# EAGLE design encoder_board (EAGLE 9.4.2)

## Sheet 1 of 4
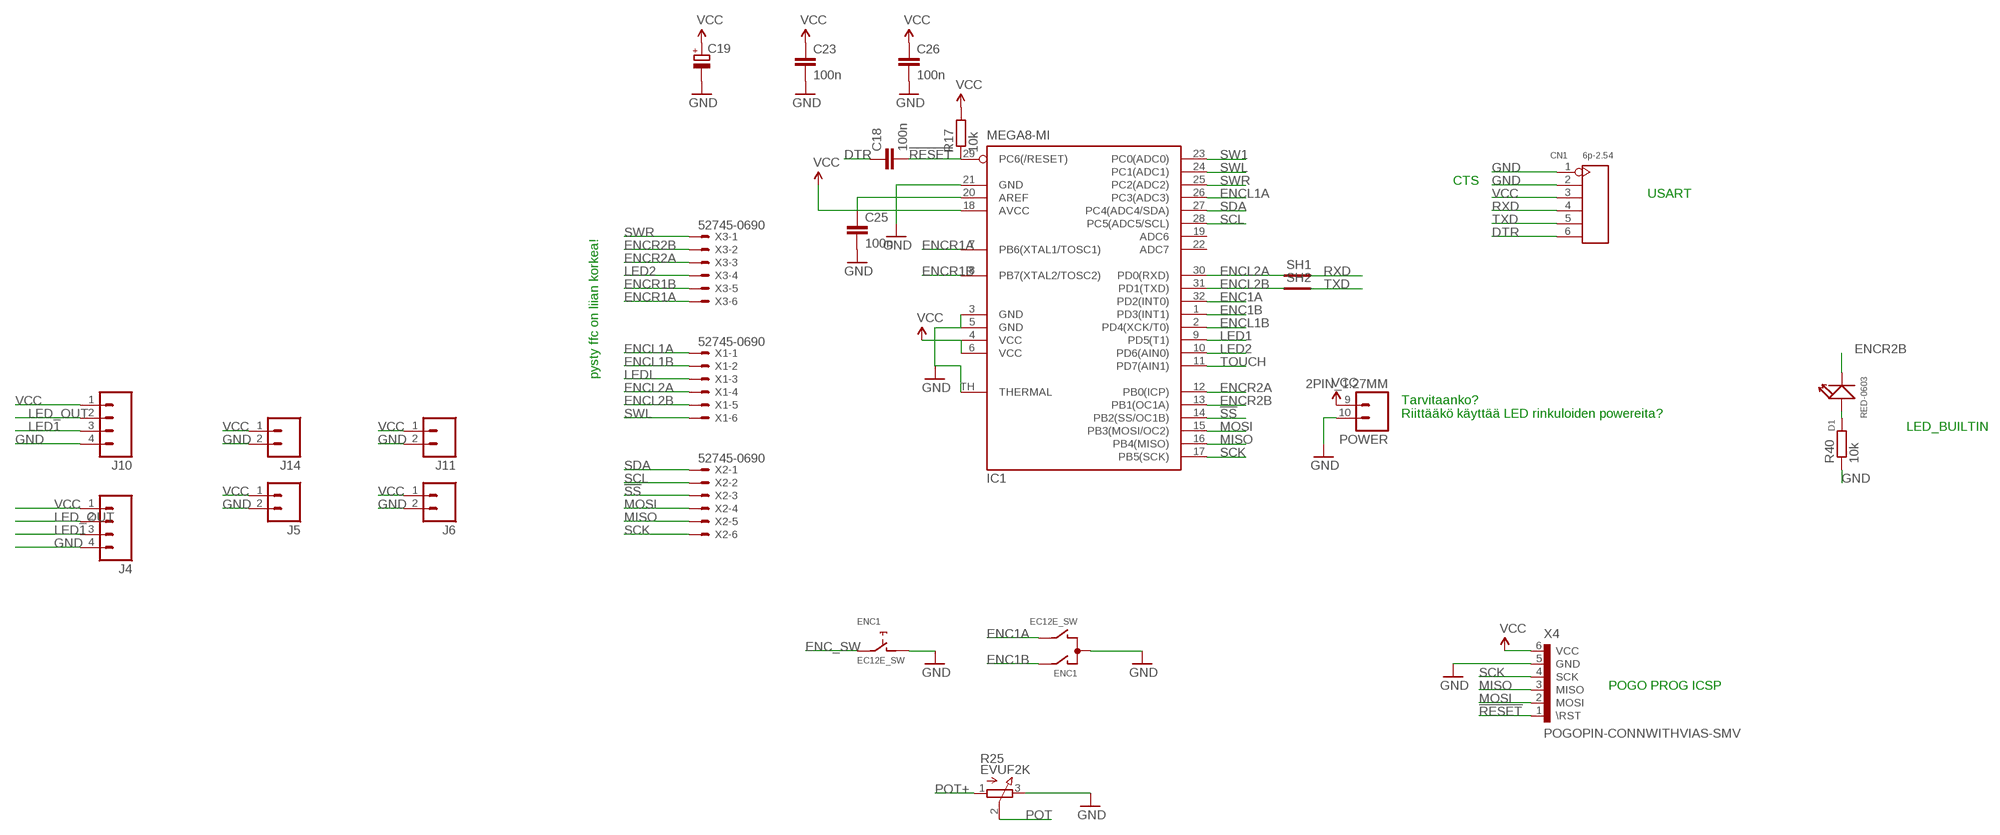
[diagram p0: schematic, sheet 1]

### Parts
C18  100n  CAP0603-CAP  [0603-CAP]
C19  CPOL-EUC  [PANASONIC_C]
C23  100n  CAP0603-CAP  [0603-CAP]
C25  100n  CAP0603-CAP  [0603-CAP]
C26  100n  CAP0603-CAP  [0603-CAP]
CN1  6p-2.54  DIP-BLACK-FEMALE-HEADER-VERT(6P-2.54)  [H6-2.54]
D1  RED-0603  LED-SMD-RED-DIFFUSED(0603)  [LED-0603]
ENC1  EC12E_SW  [ALPS_EC12E_SW]
IC1  MEGA8-MI  [MLF32-TH]
J4  M04NO_SILK_ALL_ROUND  [1X04_NO_SILK_ALL_ROUND]
J5  M021X02_NO_SILK  [1X02_NO_SILK]
J6  M021X02_NO_SILK  [1X02_NO_SILK]
J10  M04NO_SILK_ALL_ROUND  [1X04_NO_SILK_ALL_ROUND]
J11  M021X02_NO_SILK  [1X02_NO_SILK]
J14  M021X02_NO_SILK  [1X02_NO_SILK]
POWER  2PIN_1.27MM  [1X02_1.27MM_NO_SILK]
R17  10k  R-EU_R0603  [R0603]
R25  EVUF2K  [EVUFXK]
R40  10k  R-EU_R0603  [R0603]
SH1  SHORT  [SHORT_TOP_8MIL]
SH2  SHORT  [SHORT_TOP_8MIL]
X1  52745-0690  [52745-0690]
X2  52745-0690  [52745-0690]
X3  52745-0690  [52745-0690]
X4  POGOPIN-CONNWITHVIAS-SMV  [POGOPROG-CONN-OH-SMALLERVIAS]

### Nets
!RESET: C18.2 IC1.29(PC6(/RESET)) R17.1 X4.1(\RST)
!SS: IC1.14(PB2(SS/OC1B)) X2.3
AREF: C25.1 IC1.20(AREF)
DTR: C18.1 CN1.6
ENC1A: ENC1.B IC1.32(PD2(INT0)) ; also sheet 4
ENC1B: ENC1.A IC1.1(PD3(INT1)) ; also sheet 4
ENC_SW: ENC1.E ; also sheet 4
ENCL1A: IC1.26(PC3(ADC3)) X1.1 ; also sheet 4
ENCL1B: IC1.2(PD4(XCK/T0)) X1.2 ; also sheet 4
ENCL2A: IC1.30(PD0(RXD)) SH1.P$1 X1.4 ; also sheet 4
ENCL2B: IC1.31(PD1(TXD)) SH2.P$1 X1.5 ; also sheet 4
ENCR1A: IC1.7(PB6(XTAL1/TOSC1)) X3.6 ; also sheet 4
ENCR1B: IC1.8(PB7(XTAL2/TOSC2)) X3.5 ; also sheet 4
ENCR2A: IC1.12(PB0(ICP)) X3.3 ; also sheet 4
ENCR2B: D1.- IC1.13(PB1(OC1A)) X3.2 ; also sheet 4
GND: C19.- C23.2 C25.2 C26.2 CN1.1 CN1.2 ENC1.C ENC1.D IC1.3(GND) IC1.5(GND) IC1.21(GND) IC1.TH(THERMAL) J4.4 J5.2 J6.2 J10.4 J11.2 J14.2 POWER.10 R25.3(E) R40.1 X4.5(GND) ; also sheet 2,3
LED1: IC1.9(PD5(T1)) J4.3 J10.3 ; also sheet 4
LED2: IC1.10(PD6(AIN0)) X3.4 ; also sheet 4
LED_OUT: J4.2 J10.2 ; also sheet 4
LEDL: X1.3 ; also sheet 4
MISO: IC1.16(PB4(MISO)) X2.5 X4.3(MISO) ; also sheet 2
MOSI: IC1.15(PB3(MOSI/OC2)) X2.4 X4.2(MOSI) ; also sheet 2
N$31: D1.+ R40.2
POT: R25.2(S) ; also sheet 4
POT+: R25.1(A) ; also sheet 4
RXD: CN1.4 SH1.P$2
SCK: IC1.17(PB5(SCK)) X2.6 X4.4(SCK) ; also sheet 2
SCL: IC1.28(PC5(ADC5/SCL)) X2.2
SDA: IC1.27(PC4(ADC4/SDA)) X2.1
SW1: IC1.23(PC0(ADC0)) ; also sheet 4
SWL: IC1.24(PC1(ADC1)) X1.6 ; also sheet 4
SWR: IC1.25(PC2(ADC2)) X3.1 ; also sheet 4
TOUCH: IC1.11(PD7(AIN1)) ; also sheet 3,4
TXD: CN1.5 SH2.P$2
VCC: C19.+ C23.1 C26.1 CN1.3 IC1.4(VCC) IC1.6(VCC) IC1.18(AVCC) J4.1 J5.1 J6.1 J10.1 J11.1 J14.1 POWER.9 R17.2 X4.6(VCC) ; also sheet 3,4
Unconnected: ENC1.GND1(G) ENC1.GND2(G) IC1.19(ADC6) IC1.22(ADC7)

### Notes on the sheet
- CTS
- USART
- pysty ffc on liian korkea!
- Tarvitaanko?
  Riittääkö käyttää LED rinkuloiden powereita?
- LED_BUILTIN
- POGO PROG ICSP

## Sheet 2 of 4
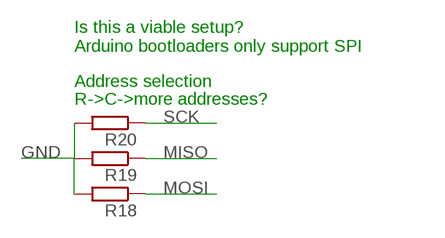
[diagram p1: schematic, sheet 2]

### Parts
R18  R-EU_R0603  [R0603]
R19  R-EU_R0603  [R0603]
R20  R-EU_R0603  [R0603]

### Nets
GND: R18.2 R19.2 R20.2 ; also sheet 1,3
MISO: R19.1 ; also sheet 1
MOSI: R18.1 ; also sheet 1
SCK: R20.1 ; also sheet 1

### Notes on the sheet
- Is this a viable setup?
  Arduino bootloaders only support SPI
- Address selection
- R->C->more addresses?

## Sheet 3 of 4
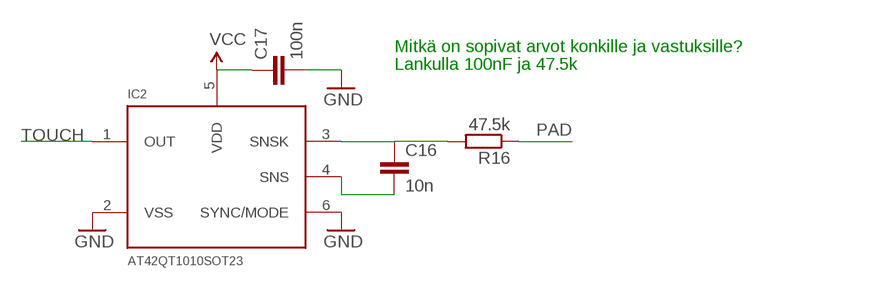
[diagram p2: schematic, sheet 3]

### Parts
C16  10n  CAP0603-CAP  [0603-CAP]
C17  100n  CAP0603-CAP  [0603-CAP]
IC2  AT42QT1010SOT23  [SOT23-6]
R16  47.5k  R-EU_R0603  [R0603]

### Nets
GND: C17.2 IC2.2(VSS) IC2.6(SYNC/MODE) ; also sheet 1,2
N$7: C16.1 IC2.3(SNSK) R16.2
N$15: C16.2 IC2.4(SNS)
PAD: R16.1
TOUCH: IC2.1(OUT) ; also sheet 1,4
VCC: C17.1 IC2.5(VDD) ; also sheet 1,4

### Notes on the sheet
- Mitkä on sopivat arvot konkille ja vastuksille?
- Lankulla 100nF ja 47.5k

## Sheet 4 of 4
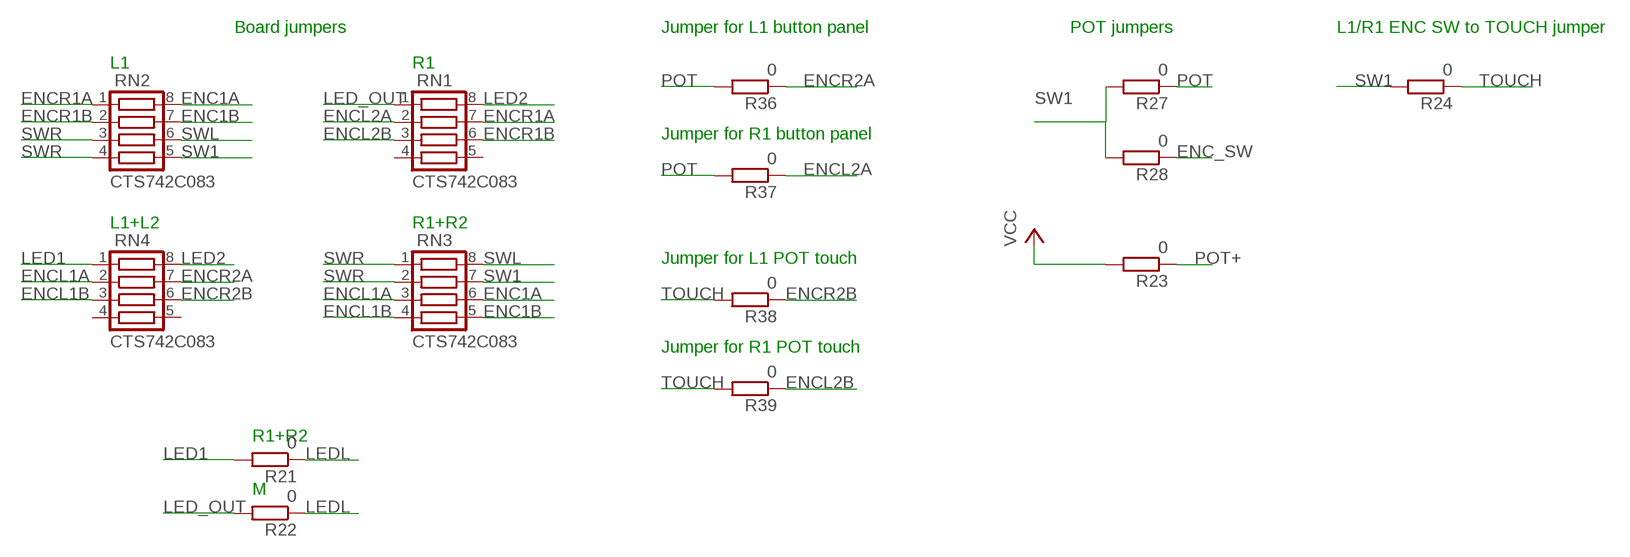
[diagram p3: schematic, sheet 4]

### Parts
R21  0  R-EU_R0603  [R0603]
R22  0  R-EU_R0603  [R0603]
R23  0  R-EU_R0603  [R0603]
R24  0  R-EU_R0603  [R0603]
R27  0  R-EU_R0603  [R0603]
R28  0  R-EU_R0603  [R0603]
R36  0  R-EU_R0603  [R0603]
R37  0  R-EU_R0603  [R0603]
R38  0  R-EU_R0603  [R0603]
R39  0  R-EU_R0603  [R0603]
RN1  CTS742C083  [CTS742C083]
RN2  CTS742C083  [CTS742C083]
RN3  CTS742C083  [CTS742C083]
RN4  CTS742C083  [CTS742C083]

### Nets
ENC1A: RN2.8 RN3.6 ; also sheet 1
ENC1B: RN2.7 RN3.5 ; also sheet 1
ENC_SW: R28.1 ; also sheet 1
ENCL1A: RN3.3 RN4.2 ; also sheet 1
ENCL1B: RN3.4 RN4.3 ; also sheet 1
ENCL2A: R37.1 RN1.2 ; also sheet 1
ENCL2B: R39.1 RN1.3 ; also sheet 1
ENCR1A: RN1.7 RN2.1 ; also sheet 1
ENCR1B: RN1.6 RN2.2 ; also sheet 1
ENCR2A: R36.1 RN4.7 ; also sheet 1
ENCR2B: R38.1 RN4.6 ; also sheet 1
LED1: R21.2 RN4.1 ; also sheet 1
LED2: RN1.8 RN4.8 ; also sheet 1
LED_OUT: R22.2 RN1.1 ; also sheet 1
LEDL: R21.1 R22.1 ; also sheet 1
POT: R27.1 R36.2 R37.2 ; also sheet 1
POT+: R23.1 ; also sheet 1
SW1: R24.2 R27.2 R28.2 RN2.5 RN3.7 ; also sheet 1
SWL: RN2.6 RN3.8 ; also sheet 1
SWR: RN2.3 RN2.4 RN3.1 RN3.2 ; also sheet 1
TOUCH: R24.1 R38.2 R39.2 ; also sheet 1,3
VCC: R23.2 ; also sheet 1,3
Unconnected: RN1.4 RN1.5 RN4.4 RN4.5

### Notes on the sheet
- Board jumpers | Jumper for L1 button panel | POT jumpers | L1/R1 ENC SW to TOUCH jumper
- L1 | R1
- Jumper for R1 button panel
- L1+L2 | R1+R2
- Jumper for L1 POT touch
- Jumper for R1 POT touch
- R1+R2
- M

## Library data of the parts
C16-C18 C23 C25 C26 = SparkFun-Capacitors:CAP: Capacitor Standard 0603 ceramic capacitor, and 0.1" leaded capacitor.
C19 = rcl:CPOL-EU: POLARIZED CAPACITOR, European symbol; SPICEPREFIX: C
CN1 = i2c_encoder:DIP-BLACK-FEMALE-HEADER-VERT(6P-2.54): 320030060; MPN: F185-1106A1BSYC1
D1 = Seeed-LED-2016:LED-SMD-RED-DIFFUSED(0603): 304090042; MPN: 19-217-R6C-AL1M2VY-3T
ENC1 = switch_pec:EC12E_SW: ALPS rotary Encoder EC12E series with switch; MPN: EC12E2424407; OC_FARNELL: 1520813; OC_NEWARK: 74M1068
IC1 = atmel:MEGA8-MI: MICROCONTROLLER 8 Kbytes FLASH, 1 kbytes SRAM, 512 bytes EEPROM, USART, 6-channel 10 bit ADC, 2-channel 8 bit ADC Pin compatible with Atmega48, ATMega88, ATMega168 Source: avr.lbr; MPN: ATMEGA88PA-MU; OC_FARNELL: 1715491; OC_NEWARK: 15R0272
IC2 = touch_sensor:AT42QT1010: Atmel AT42QT1010 The AT42QT1010 (QT1010) is a digital burst mode charge-transfer (QT™) sensor that is capable of detecting nearproximityor touch, making it ideal for implementing touch controls.The QT1010 is designed specifically for human interfaces, like control panels, appliances, toys, lighting controls, or anywhere a mechanical switch or button may be found. It includes all hardware and signal processing functions necessary to provide stable sensing under a wide variety of changing conditions. Only a single low-cost capacitor is required for operation. This chip is identical to the AT42QT1011, however the capsense times out after 60 seconds. Reciprocally, the capsense on the 1011 never times out. Reference "Signal Processing" in the datasheet. Datasheet <http://www.atmel.com/images/Atmel-9541-AT42-QTouch-BSW-AT42QT1010_Datasheet.pdf> Sparkfun Products Sparkfun Capacitive Touch Breakout <https://www.sparkfun.com/products/12041> (SEN-12041)
J4 J10 = i2c_encoder:M04: Header 4 Standard 4-pin 0.1" header. Use with straight break away headers (SKU : PRT-00116), right angle break away headers (PRT-00553), swiss pins (PRT-00743), machine pins (PRT-00117), and female headers (PRT-00115). Molex polarized connector foot print use with SKU : PRT-08231 with associated crimp pins and housings. 1MM SMD Version SKU: PRT-10208; PROD_ID: CONN-09696
J5 J6 J11 J14 = i2c_encoder:M02: Standard 2-pin 0.1" header. Use with - straight break away headers ( PRT-00116) - right angle break away headers (PRT-00553) - swiss pins (PRT-00743) - machine pins (PRT-00117) - female headers (PRT-00115) Molex polarized connector foot print use with: PRT-08233 with associated crimp pins and housings. 2.54_SCREWTERM for use with PRT-10571. 3.5mm Screw Terminal footprints for PRT-08084 5mm Screw Terminal footprints for use with PRT-08432
POWER = edge:2PIN_1.27MM
R16-R21 R40 = rcl:R-EU_: RESISTOR, European symbol
R22-R24 R27 R28 R36-R39 = rcl:R-EU_: RESISTOR, European symbol; SPICEPREFIX: R
R25 = i2c_encoder:EVU: Potentiometer modified from "9 mm Square Rotary Potentiometers (Source: Panasonic)"
RN1-RN4 = resistor-net:CTS742C083: Chip Resistor Array 4 Single Resistor Source: http://www.ctscorp.com/components/Datasheets/CTSChipArrayDs.pdf; OC_FARNELL: unknown; OC_NEWARK: unknown
SH1 SH2 = shorts:SHORT: Short between two nets
X1-X3 = i2c_encoder:52745-0690: FFC/FPC-to-Board 0.50mm (.020") SMT Top Contact Right Angle, ZIF, Style Receptacle 52745 / 52435 Source: http://www.molex.com/product/ffc/52745.html; MF: MOLEX; MPN: 52745-0690; OC_FARNELL: unknown; OC_NEWARK: 92M6374
X4 = Protofusion:POGOPIN-CONN: Protofusion custom pogo pin programming header

## Board
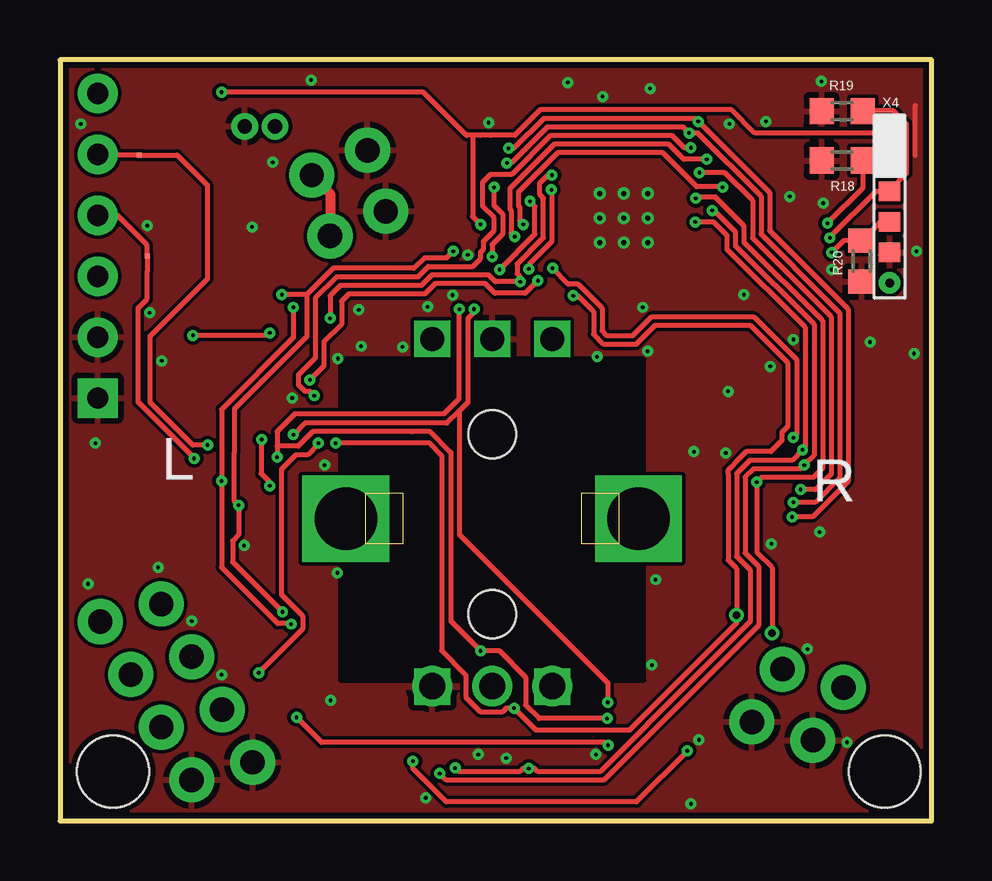
[diagram p4: board, top side]
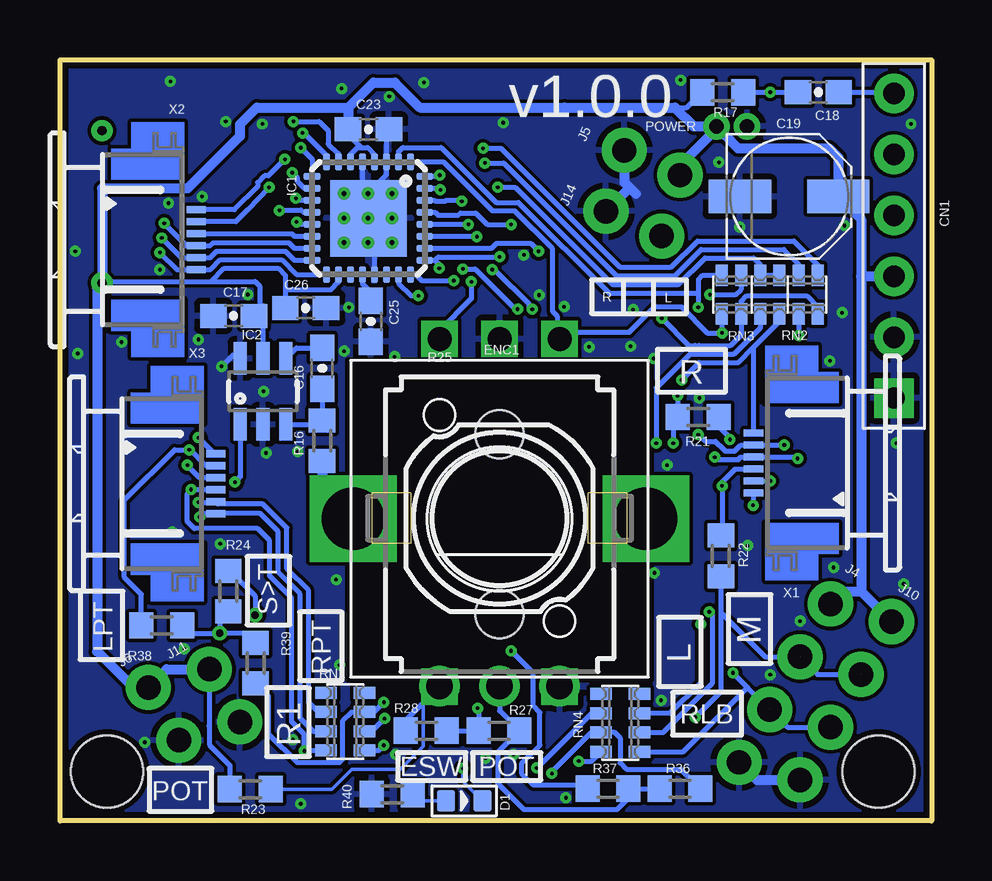
[diagram p5: board, bottom side, seen from below]

Size 36.32 x 31.72 mm. Coordinates in mm from the lower left corner, seen from the top.
Outline: 36.32,31.73 0,31.73 0,0 36.32,0 36.32,31.67
Copper layers (1*16): Top 0.035mm / dielectric 1.5mm / Bottom 0.035mm
Design rules "SeeedStudio_2layer_DRU_no_angle_20140221": minimum track width 6mil, minimum drill 12mil, track to track 6mil, track to pad 6mil, pad to pad 6mil, via to via 6mil, smd to smd 0mil, copper to edge 10mil, drill to drill 10mil, minimum pad ring 10mil, minimum via ring 6mil, stop-mask expansion 2mil, vias tented up to drill 100mil, thermal gap 10mil
Holes 3 mm at 34.37,2.06 2.21,2.06
tRestrict: area 11.7,5.9 to 24.3,19.3
bRestrict: area 11.7,5.9 to 24.3,19.2

### Footprints (pad centres in the part's own frame; a part is rotated, then mirrored left to right if it is on the bottom)
0603-CAP = smd 1.1 x 1: 1 -0.85,0; 2 0.85,0
PANASONIC_C = smd 2.6 x 1.4: + 2.05,0; - -2.05,0
H6-2.54 = drill 0.889 pad 1.651 square: 1 0,6.35 | drill 0.889 pad 1.651: 2 0,3.81; 3 0,1.27; 4 0,-1.27; 5 0,-3.81; 6 0,-6.35
LED-0603 = smd 0.762 x 0.889: + -0.762,0; - 0.762,0
ALPS_EC12E_SW = drill 1 square: A -2.5,-7.5; B 2.5,-7.5; C 0,-7.5; D -2.5,7; E 2.5,7 | drill 2.6 square: GND1 -6.1,0; GND2 6.1,0
MLF32-TH = smd 0.7 x 0.3: 1 -2.35,1.75; 2 -2.35,1.25; 3 -2.35,0.75; 4 -2.35,0.25; 5 -2.35,-0.25; 6 -2.35,-0.75; 7 -2.35,-1.25; 8 -2.35,-1.75; 17 2.35,-1.75; 18 2.35,-1.25; 19 2.35,-0.75; 20 2.35,-0.25; 21 2.35,0.25; 22 2.35,0.75; 23 2.35,1.25; 24 2.35,1.75 | smd 0.3 x 0.7: 9 -1.75,-2.35; 10 -1.25,-2.35; 11 -0.75,-2.35; 12 -0.25,-2.35; 13 0.25,-2.35; 14 0.75,-2.35; 15 1.25,-2.35; 16 1.75,-2.35; 25 1.75,2.35; 26 1.25,2.35; 27 0.75,2.35; 28 0.25,2.35; 29 -0.25,2.35; 30 -0.75,2.35; 31 -1.25,2.35; 32 -1.75,2.35 | smd 3.2 x 3.2: TH 0,0
SOT23-6 = smd 0.55 x 1.35: 1 -0.95,-1.375; 2 0,-1.375; 3 0.95,-1.375; 4 0.95,1.375; 5 0,1.375; 6 -0.95,1.375
1X04_NO_SILK_ALL_ROUND = drill 1.016 pad 1.88: 1 0,0; 2 2.54,0; 3 5.08,0; 4 7.62,0
1X02_NO_SILK = drill 1.016 pad 1.88: 1 0,0; 2 2.54,0
1X02_1.27MM_NO_SILK = drill 0.6: 9 0,0; 10 1.27,0
R0603 = smd 1 x 1.1: 1 -0.85,0; 2 0.85,0
EVUFXK = drill 1.1 pad 1.676: 1 -2.5,-7; 2 0,-7; 3 2.5,-7 | hole 2: 0,3.5; 0,-4
CTS742C083 = smd 0.5 x 0.9: 1 -1.2,-0.8; 2 -0.4,-0.8; 3 0.4,-0.8; 4 1.2,-0.8; 5 1.2,0.8; 6 0.4,0.8; 7 -0.4,0.8; 8 -1.2,0.8
SHORT_TOP_8MIL = smd 0.203 x 0.203: P$1 0,0; P$2 0,0
52745-0690 = smd 0.3 x 0.8: 1 -1.25,2.5; 2 -0.75,2.5; 3 -0.25,2.5; 4 0.25,2.5; 5 0.75,2.5; 6 1.25,2.5
POGOPROG-CONN-OH-SMALLERVIAS = drill 0.381: 1 0,2.54; 6 0,-3.81 | smd 0.889 x 0.813: 2 0,1.27; 3 0,0; 4 0,-1.27; 5 0,-2.54

### Placement (x,y rotation side)
C16  25.4,18.87 90 bottom
C17  29.08,21.06 180 bottom
C18  4.72,30.38 180 bottom
C19  5.94,26.04 0 bottom
C23  23.47,28.83 0 bottom
C25  23.37,20.83 270 bottom
C26  26.09,21.39 0 bottom
CN1  1.57,23.98 180 bottom
D1  19.48,0.84 0 bottom
ENC1  18.01,12.6 180 bottom
IC1  23.47,25.12 270 bottom
IC2  27.86,17.91 0 bottom
J4  4.22,9.04 240 bottom
J5  10.49,26.92 156 bottom
J6  32.64,5.56 300 bottom
J10  1.68,8.31 240 bottom
J11  30.1,6.32 300 bottom
J14  11.25,24.38 156 bottom
POWER  8.97,28.96 0 bottom
R16  25.4,15.85 90 bottom
R17  8.71,30.38 180 bottom
R18  32.59,27.53 180 top
R19  32.59,29.59 180 top
R20  33.4,23.34 270 top
R21  9.73,16.84 180 bottom
R22  8.79,11.05 270 bottom
R23  28.4,1.32 180 bottom
R24  29.31,9.58 90 bottom
R25  18.01,12.62 0 bottom
R27  18.03,3.76 180 bottom
R28  21.06,3.76 0 bottom
R36  10.49,1.35 180 bottom
R37  13.49,1.35 0 bottom
R38  32.08,8.15 0 bottom
R39  28.17,6.58 90 bottom
R40  22.48,1.12 0 bottom
RN1  24.43,4.14 90 bottom
RN2  5.94,21.95 180 bottom
RN3  7.54,21.95 180 bottom
RN4  12.98,4.09 90 bottom
SH1  3.63,23.55 0 top
SH2  3.3,27.76 0 top
X1  4.93,14.92 90 bottom
X2  33.15,24.23 270 bottom
X3  32.33,14.06 270 bottom
X4  34.57,26.24 0 top

### Tracks (layer width: path | path; a pad name or v marks a point on that pad's centre or on a via)
!RESET  (via drill 0.15, 0.15 pad 0.15)
  Top 0.203: X4.1 34.47,28.68 28.95,28.68 27.99,29.64 20.02,29.65 18.95,28.59 17.93,28.58 17.52,28.58 | 17.52,28.58 17.2,28.58 17.2,25.2 v17.53,24.87 | v6.73,30.38 15.14,30.38 16.94,28.58 16.97,28.58 17.52,28.58
  Bottom 0.203: C18.2 v6.73,30.38 R17.1 | v17.53,24.87 18.52,24.87 19,25.35 19.64,25.35 19.74,25.25 20.57,25.25 20.69,25.37 IC1.29
!SS
  Bottom 0.203: IC1.14 26.55,24.37 26.66,24.48 X2.3
AREF
  Bottom 0.203: C25.1 23.37,22.05 23.72,22.4 IC1.20
DTR
  Bottom 0.203: C18.1 1.63,30.38 CN1.6
ENC1A  (via drill 0.15)
  Top 0.203: v11.25,20.95 11.25,21.89 11.68,22.33 15.06,22.33 15.49,22.76 17.86,22.76 18.14,22.48 v19.18,22.48 19.18,22.69 19.05,22.81 19.05,23.22 20.14,24.31 20.14,25.96 19.99,26.11 19.99,26.59 20.32,26.92 v20.5,26.92
  Bottom 0.203: ENC1.B 20.51,20.44 19.18,21.77 v19.18,22.48 | 4.74,21.09 4.75,21.1 RN2.8 4.74,21.43 5.21,21.9 7.7,21.9 7.94,21.66 RN3.6 7.94,20.26 8.38,19.82 9.71,19.82 9.86,19.82 | v11.25,20.95 10.12,19.82 9.86,19.82 | 9.86,19.82 | IC1.32 20.55,26.87 v20.5,26.92
ENC1B  (via drill 0.15)
  Top 0.203: v5.54,20.24 8.64,20.24 v8.74,20.34
  Bottom 0.203: RN2.7 v5.54,20.24 | RN3.5 v8.74,20.35 v8.74,20.34 9.34,20.34 10.44,21.44 11.54,21.44 12.6,20.37 15.24,20.37 ENC1.A 15.6,20.19 15.6,21.04 15.8,21.24 15.8,23.86 17.37,25.43 18.3,25.43 20.34,27.47 IC1.1
ENC_SW
  Bottom 0.203: R28.1 21.91,4.2 ENC1.E
ENCL1A  (via drill 0.15)
  Top 0.203: 10.29,21.95 10.29,20.2 7.26,17.18 7.26,15.37 7.26,13.34 v7.44,13.16 7.44,11.94 7.19,11.68 7.19,10.79 v9.27,8.71 | 10.29,21.95 v9.25,21.95 | 10.29,21.95 11.38,23.04 14.76,23.04 15.19,23.47 16.1,23.47 v16.38,23.75
  Bottom 0.203: v9.25,21.95 8.16,21.95 7.94,22.16 RN3.3 | X1.1 7.43,13.17 v7.44,13.16 | RN4.2 11.2,3.69 9.14,5.74 9.14,8.59 v9.27,8.71 | v16.38,23.75 16.71,24.08 18.13,24.08 18.34,23.87 IC1.26
ENCL1B  (via drill 0.15)
  Top 0.203: v9.73,21.41 9.73,20.14 6.74,17.16 6.74,14.23 v6.73,14.17 6.73,10.57 9.07,8.23 9.6,8.23 v9.63,8.2
  Bottom 0.203: IC1.2 22.23,27.57 22.23,27.88 22.03,28.07 20.44,28.07 18.42,26.05 18.15,25.78 17.22,25.78 13.45,22 9.73,22 | RN3.4 9.53,22.75 9.73,22.55 9.73,22 | 9.73,22 v9.73,21.41 | X1.2 6.88,14.17 6.76,14.17 | RN4.3 10.89,4.5 9.63,5.76 v9.63,8.2
  Bottom 0.406: 6.76,14.17 v6.73,14.17
ENCL2A  (via drill 0.15, 0.15 pad 0.15)
  Top 0.203: v16.64,21.33 16.62,21.31 16.62,17.6 15.99,16.97 9.78,16.97 9.04,16.23 9.04,15.62 | 9.04,15.62 9.93,15.62 10.54,16.23 14.66,16.23 15.42,16.23 16.28,15.37 16.28,8.33 v17.53,7.09 18.31,7.09 19.41,5.99 19.41,4.83 19.96,4.27 v22.8,4.27 | v18.31,22.99 19.79,24.46 19.79,25.63 v19.58,25.83 | 9.04,15.62 v9.04,15.16 | v5.59,15.11 5.59,15.12 3.25,17.46 3.25,21.38 3.63,21.77 3.63,22.78 3.63,22.89 SH1.P$1
  Bottom 0.203: v16.64,21.33 16.77,21.46 16.77,21.54 18.22,22.99 v18.31,22.99 | v22.8,4.27 23.32,3.74 RN1.2 | v9.04,15.16 8.94,15.06 8.06,15.06 7.96,15.16 X1.4 5.65,15.17 v5.59,15.11 | R37.1 14.49,1.5 16.6,1.5 17.09,2 17.09,2.4 16.33,3.16 16.33,4.51 16.63,4.81 16.63,6.19 v17.53,7.09 | v19.58,25.83 19.62,25.87 20.23,25.87 20.27,25.83 20.67,25.83 20.71,25.87 IC1.30
ENCL2B  (via drill 0.15, 0.15 pad 0.15)
  Top 0.203: 16.64,17.1 16.12,16.59 10.2,16.59 v9.74,16.1 v9.73,16.1 | 16.64,17.1 16.99,17.45 16.99,20.95 17.25,21.21 v17.25,21.34 | 16.64,17.1 16.64,11.95 22.82,5.76 v22.82,4.95 | v19.53,23.01 19.53,23.19 20.5,24.16 20.5,26.29 v20.47,26.31 | v6.15,15.67 5.54,15.67 3.76,17.45 3.76,20.21 6.15,22.6 6.15,26.49 4.88,27.76 SH2.P$1
  Bottom 0.152: v6.15,15.67
  Bottom 0.203: v9.73,16.1 9.72,16.1 9.44,15.82 9.02,15.82 8.87,15.67 8.86,15.67 8.61,15.42 8.21,15.42 7.95,15.67 X1.5 v6.15,15.67 | v17.25,21.34 17.35,21.34 19.02,23.01 v19.53,23.01 | v22.82,4.95 23.23,4.54 23.23,4.55 RN1.3 24.18,4.54 24.53,4.18 24.53,2.58 24.68,2.44 26.44,2.44 27.64,3.63 27.64,5.2 R39.1 | IC1.31 20.53,26.37 v20.47,26.31
ENCR1A  (via drill 0.15)
  Top 0.203: v30.5,12.68 31.36,12.68 32.84,14.16 32.84,21.34 32.33,21.84 32.33,21.85 29.57,24.62 29.57,26.19 26.63,29.13 26.62,29.13 v26.59,29.16 26.47,29.29 20.15,29.29 18.91,28.04 v18.7,28.04 v18.69,28.04
  Bottom 0.203: RN1.7 25.77,3.73 26.31,4.28 26.31,9.45 27.23,10.37 27.23,12.06 27.97,12.81 X3.6 30.35,12.81 30.36,12.8 30.38,12.8 v30.5,12.68 | v26.59,29.16 25.53,29.16 25.15,28.78 25.15,28.22 24.72,27.82 IC1.7 | RN2.1 4.74,23.18 5.74,24.18 9.76,24.18 10.84,23.09 13,23.09 17.95,28.04 v18.69,28.04
ENCR1B  (via drill 0.15)
  Top 0.203: v30.56,13.28 31.46,13.28 32.49,14.31 32.49,21.18 31.98,21.69 31.98,21.7 29.21,24.47 29.21,26.05 26.58,28.68 v26.21,28.68 25.96,28.93 25.83,28.93 20.3,28.93 18.8,27.43 v18.62,27.43
  Bottom 0.203: RN1.6 25.56,4.54 25.96,4.94 25.96,9.6 26.87,10.52 26.87,12.22 27.87,13.21 29.74,13.21 X3.5 29.86,13.28 v30.56,13.28 | IC1.8 25.22,27.76 26.14,28.68 v26.21,28.68 | RN2.2 5.54,23.21 6.16,23.82 9.61,23.82 10.7,22.74 13.15,22.74 17.84,27.43 v18.62,27.43
ENCR2A  (via drill 0.15, 0.15 pad 0.15)
  Top 0.203: v27.18,25.45 27.25,25.45 28.14,24.56 28.14,23.98 31.42,20.71 31.42,15.24 v31.01,14.83 30.86,14.68 28.9,14.68 28.55,14.34 28.55,11.17 29.11,10.61 29.11,8.16 22.65,1.7 16.1,1.7 v15.82,1.98
  Bottom 0.203: v27.18,25.45 27.16,25.47 26.28,25.47 26.18,25.37 IC1.12 | X3.3 30.51,14.31 31.01,14.81 v31.01,14.83 | v15.82,1.98 15.82,2.06 14.19,3.69 RN4.7 13.2,3.69 12.98,3.47 12.98,2.42 12.72,2.16 10.45,2.16 R36.1
ENCR2B  (via drill 0.15, 0.15 pad 0.15)
  Top 0.203: v26.47,24.97 27.23,24.97 27.79,24.41 27.79,23.84 31.04,20.58 31.04,15.57 v30.94,15.47 30.5,15.04 28.75,15.04 28.63,14.92 28.54,14.83 28.32,14.6 28.19,14.48 28.19,11.02 28.75,10.46 28.75,8.31 26.39,5.95 26.39,5.94 22.5,2.06 19.91,2.06 19.79,2.18 v19.53,2.18 19.28,2.18 19.15,2.06 16.61,2.06 v16.46,2.21
  Bottom 0.152: D1.- 19.53,1.65 v19.53,2.18
  Bottom 0.203: IC1.13 26.37,24.87 v26.47,24.97 | v16.46,2.21 16.44,2.21 14.16,4.49 RN4.6 | X3.2 29.85,14.83 30.26,14.83 30.9,15.47 v30.94,15.47 31.55,15.47 33.64,13.38 33.64,10.15 32.93,9.45 R38.1
GND  (via drill 0.15, 0.2)
  Top 0.203: 35.62,27.75 35.62,29.81 35.64,29.82
  Bottom 0.203: 22.82,28.63 C23.2 22.72,28.73 IC1.3 22.72,26.93 v23.49,26.16 23.72,26.39 IC1.5 | IC2.6 28.81,19.43 29.11,19.43 v29.59,18.95 | IC1.21 23.22,23.84 v23.49,24.11
  Bottom 0.406: J4.4 7.29,1.71 J10.4 | J5.2 12.81,26.63 12.66,26.48 | 12.66,26.48 12.32,26.14 | J14.2 12.66,26.33 12.66,26.48
  other vias: 8,24.77 29.64,11.56 12.55,19.79 9.68,17.63 11.28,5.03 11.56,10.34 27.89,29.06 27.74,15.34 24.66,6.5 11.58,19.28 12.45,21.31 14.27,19.76 27.84,17.91 22.38,19.35 15.32,21.44 6.73,6.1 17.86,29.11 35.59,19.48 35.69,23.75 30.4,26.04 22.49,24.11 24.49,24.11 22.49,25.13 23.49,25.13 24.49,25.13 22.49,26.16 24.49,26.16 4.09,10.57 8.86,27.46 5.49,8.33 31.72,30.84 1.17,9.88 1.47,15.75 29.41,29.16 11.02,14.83 24.82,10.06 26.42,15.39 24.28,21.41 4.24,19.18 32.79,3.28 33.76,19.96 31.8,25.76 32.16,22.99 28.5,21.95 30.56,20.07 22.61,30.2 21.16,30.78 10.46,30.89 0.86,29.06 3.73,21.18 3.63,24.82 7.67,11.48 24.59,30.53 22.33,2.77 18.59,2.62 26.29,0.71 26.62,3.38 31.14,7.16 31.65,12.04 24.49,19.58 17.42,2.77 15.24,0.97 16.36,21.92 16.99,23.6
  pour Top: -2.11,34.32 39.65,34.32 39.65,-3.12 -2.11,-3.12
  pour Bottom: -2.11,34.29 39.65,34.29 39.65,-3.15 -2.11,-3.15
LED1  (via drill 0.15)  (1 unrouted)
  Top 0.203: v10.77,15.75 10.77,15.72 10.31,15.27 9.83,15.27 9.22,14.65 9.22,9.45 10.11,8.56 10.11,8 v8.28,6.17 | v10.59,17.73 10.41,17.91 10.21,17.91 9.93,18.19 9.93,18.59 10.64,19.3 10.64,21.8 11.53,22.68 14.91,22.68 15.34,23.11 17.2,23.11 17.53,23.44 17.53,23.72 17.65,23.85 17.65,24.18 18.09,24.61 18.09,25.15 17.6,25.63 17.6,26.62 17.94,26.95 18.82,26.95 20.44,28.57 25.52,28.57 26.01,28.07 v26.29,28.07
  Bottom 0.203: v10.59,17.73 10.59,17.37 R21.2 10.77,16.65 v10.77,15.75 | v8.28,6.17 7.65,5.54 | 7.65,5.54 J4.3 6.02,3.91 J10.3 | RN4.1 10.34,2.89 7.7,5.54 7.65,5.54 | IC1.9 25.82,27.6 v26.29,28.07
LED2  (via drill 0.15)
  Top 0.203: v26.64,27.03 27.69,27.03 28.85,25.88 28.85,24.3 32.13,21.02 32.13,14.46 31.49,13.82 v30.86,13.82 | v26.14,2.92 26.14,2.91 24.02,0.79 16.1,0.79 14.71,2.18 v14.71,2.49
  Bottom 0.152: v30.86,13.82 30.86,13.8
  Bottom 0.203: IC1.10 26.14,26.37 26.44,26.68 26.44,26.82 v26.64,27.03 | X3.4 30.85,13.81 v30.86,13.82 | 30.86,13.8 31.04,13.63 31.04,12.51 30.72,12.19 28.09,12.19 27.58,11.68 27.58,10.22 26.67,9.31 26.67,4.13 26.14,3.6 v26.14,2.92 | RN1.8 26.12,2.94 v26.14,2.92 | 26.15,2.94 v26.14,2.92 | RN4.8 14.18,2.49 v14.71,2.49
LED_OUT  (via drill 0.15)  (2 unrouted)
  Top 0.203: v22.84,3.15 22.71,3.27 10.9,3.27 v9.86,4.32
  Bottom 0.203: v9.86,4.32 8.79,5.38 8.79,8.69 | v9.86,4.32 | J10.2 4.75,6.11 J4.2 6.94,6.84 8.79,8.69 | R22.2 8.79,8.69 | v22.84,3.15 23.04,2.94 RN1.1
LEDL  (via drill 0.15)
  Top 0.203: v8.41,15.9 8.38,15.88 8.38,14.48 8.74,14.12 v8.74,13.97
  Bottom 0.203: X1.3 8.2,14.67 8.74,14.13 v8.74,13.97 8.74,11.95 R22.1 | R21.1 8.88,16.45 8.41,15.98 v8.41,15.9
MISO  (via drill 0.15)
  Top 0.203: R19.1 34.73,29.6 35.27,29.07 35.27,27 34.57,26.3 X4.3 33.98,26.24 32.08,24.34 v32.08,24.31
  Bottom 0.203: IC1.16 26.56,23.37 26.94,23.75 29.8,23.75 30.07,23.48 X2.5 30.66,23.5 31.27,23.5 v32.08,24.31
MOSI  (via drill 0.15)
  Top 0.203: v31.98,24.92 33.44,26.38 R18.1 33.46,27.51 X4.2
  Bottom 0.203: IC1.15 26.55,23.87 26.79,24.11 29.95,24.11 30.07,23.98 30.9,23.98 30.89,23.98 X2.4 31.07,23.98 31.98,24.89 v31.98,24.92
N$7
  Bottom 0.203: C16.1 R16.2 25.57,16.53 IC2.3
N$15
  Bottom 0.203: C16.2 26.47,19.72 IC2.4
N$31
  Bottom 0.152: R40.2 21.35,0.84 D1.+
PAD
  Bottom 0.406: R16.1 25.4,13.72
POT
  Bottom 0.203: R25.2 18.01,4.58 R27.1 18.09,2.86 18.09,1.57 16.99,0.48 13.11,0.48 12.64,0.95 R37.2 R36.2
POT+
  Bottom 0.152: R25.1 21.18,4.95 21.18,3.12 22.14,2.15 24.16,2.15 24.99,1.32 R23.1
  Bottom 0.203: 20.7,5.43 R25.1
RXD
  Top 0.203: CN1.4 2.39,25.25 3.63,24 SH1.P$2
SCK  (via drill 0.15)
  Top 0.203: v32.16,23.7 32.65,24.19 R20.1 34.18,24.97 X4.4
  Bottom 0.203: IC1.17 25.23,22.78 26.47,22.78 27.08,23.39 29.64,23.39 30.05,22.99 30.39,22.99 X2.6 31.44,22.98 v32.16,23.7
SCL  (via drill 0.15, 0.15 pad 0.15)
  Top 0.203: v27.61,26.42 27.58,26.44 26.53,26.44 25.11,27.85 20.73,27.85 19.1,26.22 19.1,25.64 19.15,25.59 19.15,25.02 v19.3,24.87
  Bottom 0.203: IC1.28 v19.31,24.87 v19.3,24.87 | v27.61,26.42 28.49,25.48 28.99,24.98 X2.2
SDA  (via drill 0.15)
  Top 0.203: v26.95,27.58 25.99,27.58 25.37,28.21 20.58,28.21 18.75,26.37 18.75,25.5 18.8,25.45 18.8,24.51 v18.95,24.36
  Bottom 0.203: IC1.27 v18.96,24.37 v18.95,24.36 | X2.1 29.05,25.48 28.09,26.44 28.09,26.62 27.81,26.9 27.64,26.9 v26.95,27.58
SW1  (via drill 0.15, 0.15 pad 0.15, 0.3 pad 0.15)
  Top 0.203: v11.48,15.75 15.4,15.75 15.9,15.24 15.9,7.1 16.92,6.09 16.92,5.16 17.54,4.53 18.43,4.53 18.59,4.7 v18.92,4.7 19.84,3.79 23.72,3.79 28.19,8.26 v28.19,8.59 28.19,10.52 27.84,10.88 27.84,14.46 27.84,14.63 27.96,14.75 28.18,14.98 | v21.39,21.89 21.57,21.89 22.23,21.23 22.23,20.3 22.66,19.86 23.99,19.86 24.78,20.65 28.78,20.65 30.32,19.11 30.32,16.44 30.07,16.2 30.07,15.85 29.62,15.39 28.6,15.39 28.18,14.98 | 28.18,14.98
  Bottom 0.203: v11.48,15.75 11.48,18.06 10.06,19.47 8.23,19.47 7.14,20.55 RN3.7 | IC1.23 22.22,22.42 21.69,21.89 v21.39,21.89 | RN3.7 | R28.2 R27.2 18.88,4.66 v18.92,4.7 | R24.2 29.25,10.43 28.19,9.37 v28.19,8.59
SWL  (via drill 0.15)
  Top 0.203: v10.41,18.39 11,18.97 11,19.96 11.73,20.7 11.73,21.67 12.04,21.97 15.21,21.97 15.64,22.4 17.71,22.4 18.11,22 19.38,22 v19.91,22.53
  Bottom 0.203: 7.43,19.73 X1.6 | 7.43,19.73 6.34,20.81 | RN3.8 6.34,20.81 | 6.34,20.81 | RN3.8 | v10.41,18.39 9.69,19.11 8.04,19.11 7.43,19.73 | v19.91,22.53 21.25,22.53 21.49,22.77 IC1.24
SWR  (via drill 0.15)
  Top 0.203: 18.09,26.42 v18.09,26.42 18.09,25.65 18.44,25.3 18.44,24.46 18.01,24.03 v18.01,23.52 | v20.52,23.04 21.18,22.38 21.59,22.38 22.59,21.38 22.59,20.44 22.81,20.22 23.85,20.22 24.63,21.01 28.93,21.01 30.69,19.24 30.69,16.11 v30.56,15.98
  Bottom 0.203: v18.09,26.42 17.35,26.42 13.3,22.36 10.55,22.36 9.45,23.47 7.42,23.47 7.14,23.19 RN2.4 | RN2.4 RN2.3 | RN2.4 | RN2.3 | IC1.25 21.1,23.39 20.7,23.39 | 20.7,23.39 20.68,23.39 20.56,23.52 v18.01,23.52 | 20.7,23.39 20.52,23.22 v20.52,23.04 | X3.1 29.9,15.32 v30.56,15.98
TOUCH  (via drill 0.15, 0.3 pad 0.15)
  Top 0.203: v26.49,25.96 26.54,26.01 27.3,26.01 28.5,24.82 28.5,24.13 31.77,20.85 31.77,14.71 31.39,14.33 29.23,14.33 v29.03,14.12 29.03,11.2 29.67,10.57 v29.67,7.82
  Bottom 0.203: v29.03,14.12 28.8,14.35 IC2.1 | IC1.11 26.14,25.87 26.15,25.88 26.42,25.88 v26.49,25.96 | R38.2 30.9,7.82 v29.67,7.82 | R24.1 29.67,8.37 v29.67,7.82 | R39.2 28.56,7.82 v29.67,7.82
TXD
  Top 0.203: SH2.P$2 1.6,27.76 CN1.5
VCC
  Top 0.406: J14.1 11.25,26.16 J5.1
  Bottom 0.203: 26.94,22.15 C26.1 | 26.94,22.15 25.03,22.15 24.72,22.45 IC1.18 | 23.77,28.07 23.51,28.07 23.22,27.79 IC1.4 | 23.77,28.07 23.93,28.07 24.22,27.79 IC1.6 | 23.77,28.07 24.17,28.47 24.17,28.83 | 27.85,19.3 IC2.5 27.86,20.69 C17.1 28,21.31 | 15.29,29.74 15.21,29.67 | 30.02,22.49 34.51,22.49 X4.6 | 28,21.31 27.85,21.48 | 30.02,22.49 28.19,22.49 28,22.3 28,21.31 | 30.02,22.49 29.47,23.04 27.23,23.04 26.94,22.74 26.94,22.15 | 10.71,29.74 10.2,29.74 R17.2 | 29.25,1.55 R23.2 29.25,2.32 30.1,3.17 30.1,3.49 30.09,3.53 30.1,3.55 30.1,3.94 30.11,3.96 30.1,4 J11.1
  Bottom 0.406: 24.17,28.83 C23.1 24.32,29.73 24.31,29.74 | 2.95,22.71 2.95,9.58 | J4.1 3.68,9.58 2.95,9.58 | 2.95,9.58 J10.1 | 2.95,9.58 | POWER.9 8.86,28.96 10.49,27.33 J5.1 | J11.1 31.88,6.33 J6.1 33.27,5.56 34.77,7.06 34.77,22.23 X4.6 34.57,26.37 31,26.37 28.83,28.55 28.83,29.03 28.12,29.74 24.31,29.74 | 2.95,22.71 CN1.3 | 2.95,22.71 2.95,25.09 C19.+ 3.89,27.67 4.27,28.05 8.07,28.05 8.61,28.58 8.61,28.6 POWER.9 | POWER.9 8.97,28.93 | POWER.9 9.92,28.96 10.71,29.74 15.29,29.74 21.32,29.74 22.36,30.79 23.27,30.79 24.31,29.74

### Text on the board
bPlace: L | R | R | S>T | M | RPT | L | LPT | RLB | R1 | POT | ESW | POT
tNames: L | R
bNames: v1.0.0
Document: the height of an SK6812 is 1.6mm where / as the height for a smd encoder is ~4.5mm | use WS2812B or SK6812 to save on gpio pins | GPIO needed: / I2C: 2 / SPI: 4 (+ interrupt?) / encoder: 2 / leds: 1 / = 5 - 7(/8) | 0.5mm FFC max current = 0.55A / http://www.axon-cable.com/publications/FFC-Flat-Cables.pdf | F+M headerit päällekkäin on noin 5.1mm? | kooderin korkeus 4+(5-7 kierteet)mm